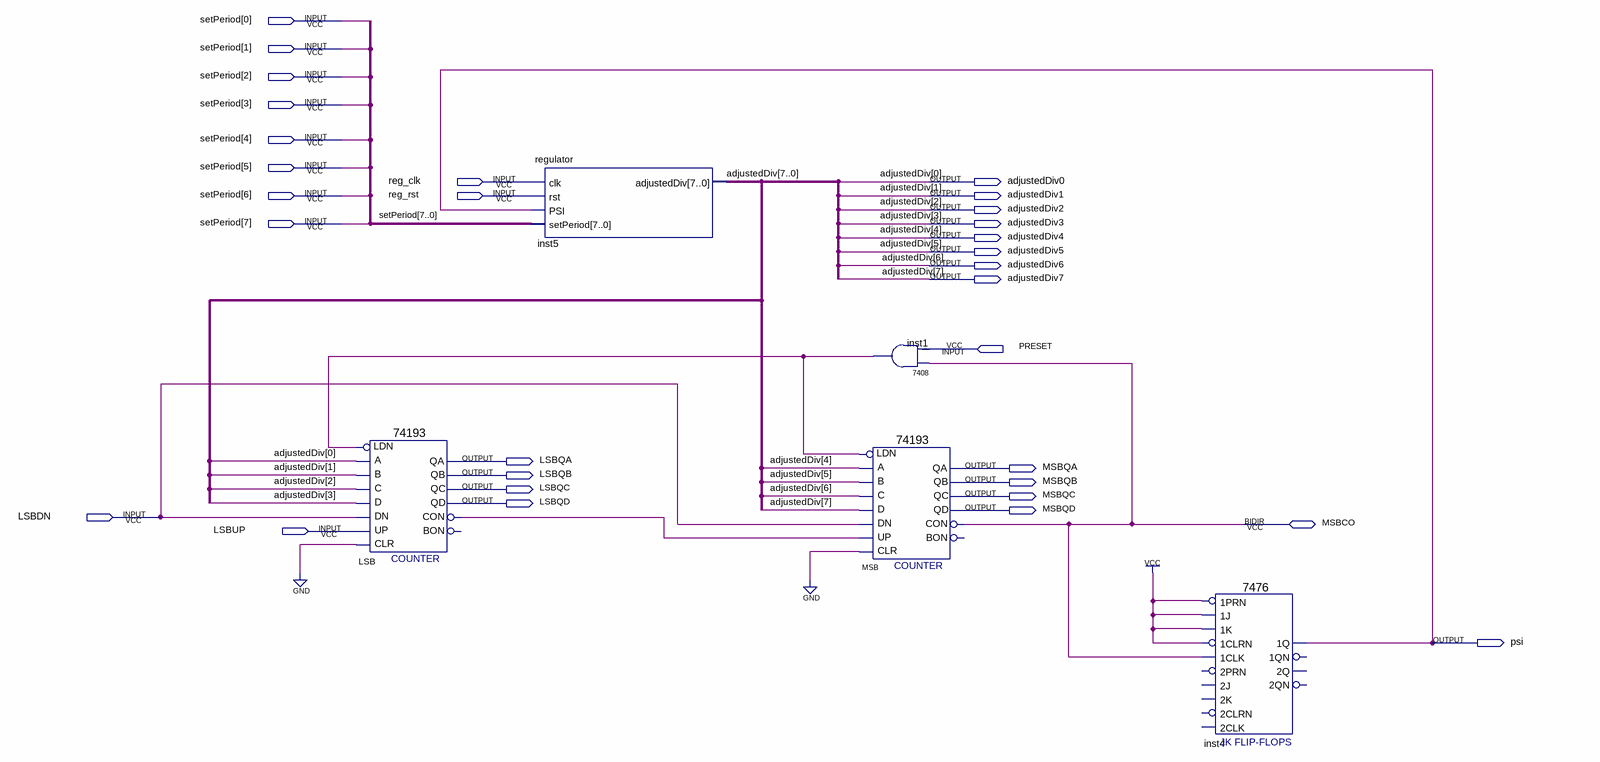
[diagram p0: schematic sheet]
// Quartus schematic freq_div_psi.bdf as structural Verilog: 5 symbols, 31 pins
module freq_div_psi (
  input  [7:0] setPeriod,
  input  reg_clk,
  input  reg_rst,
  input  PRESET,
  input  LSBDN,
  input  LSBUP,
  inout  MSBCO,
  output adjustedDiv0,
  output adjustedDiv1,
  output adjustedDiv2,
  output adjustedDiv3,
  output adjustedDiv4,
  output adjustedDiv5,
  output adjustedDiv6,
  output adjustedDiv7,
  output LSBQA,
  output MSBQA,
  output LSBQB,
  output MSBQB,
  output LSBQC,
  output MSBQC,
  output LSBQD,
  output MSBQD,
  output psi
);

  wire inst1_1, LSB_con;

  \74193  LSB (
    .D(adjustedDiv3), .C(adjustedDiv2), .B(adjustedDiv1), .A(adjustedDiv0), .CLR(1'b0), .UP(LSBUP),
    .DN(LSBDN), .LDN(inst1_1), .QB(LSBQB), .QA(LSBQA), .CON(LSB_con), .QD(LSBQD), .QC(LSBQC));  // open: BON
  regulator inst5 (
    .clk(reg_clk), .rst(reg_rst), .PSI(psi), .setPeriod(setPeriod),
    .adjustedDiv({adjustedDiv7, adjustedDiv6, adjustedDiv5, adjustedDiv4, adjustedDiv3, adjustedDiv2, adjustedDiv1, adjustedDiv0}));
  \7408  inst1 (.\3 (PRESET), .\2 (MSBCO), .\1 (inst1_1));
  \74193  MSB (
    .D(adjustedDiv7), .C(adjustedDiv6), .B(adjustedDiv5), .A(adjustedDiv4), .CLR(1'b0), .UP(LSB_con),
    .DN(LSBDN), .LDN(inst1_1), .QB(MSBQB), .QA(MSBQA), .CON(MSBCO), .QD(MSBQD), .QC(MSBQC));  // open: BON
  \7476  inst4 (
    .\1J (1'b1), .\1K (1'b1), .\1PRN (1'b1), .\1CLK (MSBCO), .\1CLRN (1'b1), .\1Q (psi));  // open: 2PRN, 2J, 2K, 2CLRN, 2CLK, 2QN, 2Q, 1QN
endmodule
